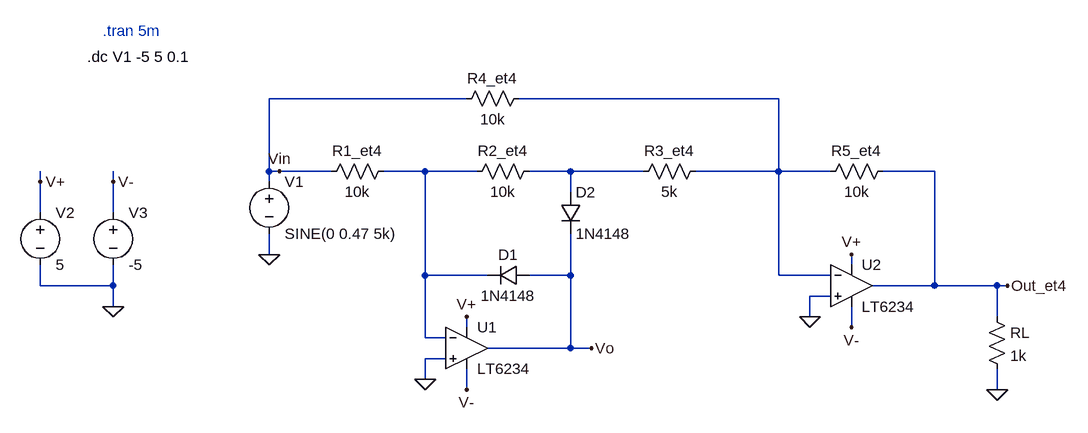
[diagram p0: schematic etaj4.asc]
etaj4.asc, the LTspice schematic file:
Version 4
SHEET 1 956 680
WIRE 0 -416 -304 -416
WIRE 480 -416 80 -416
WIRE -304 -304 -304 -416
WIRE -288 -304 -304 -304
WIRE -208 -304 -288 -304
WIRE -64 -304 -128 -304
WIRE 16 -304 -64 -304
WIRE 160 -304 96 -304
WIRE 272 -304 160 -304
WIRE 480 -304 480 -416
WIRE 480 -304 352 -304
WIRE 560 -304 480 -304
WIRE 720 -304 640 -304
WIRE -656 -288 -656 -304
WIRE -544 -288 -544 -304
WIRE -304 -288 -304 -304
WIRE 160 -272 160 -304
WIRE -656 -240 -656 -288
WIRE -544 -240 -544 -288
WIRE -304 -176 -304 -208
WIRE 592 -160 592 -176
WIRE -64 -144 -64 -304
WIRE 32 -144 -64 -144
WIRE 160 -144 160 -208
WIRE 160 -144 96 -144
WIRE 480 -144 480 -304
WIRE 560 -144 480 -144
WIRE -656 -128 -656 -160
WIRE -544 -128 -544 -160
WIRE -544 -128 -656 -128
WIRE 720 -128 720 -304
WIRE 720 -128 624 -128
WIRE 816 -128 720 -128
WIRE 832 -128 816 -128
WIRE 560 -112 528 -112
WIRE -544 -96 -544 -128
WIRE 528 -80 528 -112
WIRE 816 -80 816 -128
WIRE 0 -64 0 -80
WIRE 592 -64 592 -96
WIRE -64 -48 -64 -144
WIRE -32 -48 -64 -48
WIRE 160 -32 160 -144
WIRE 160 -32 32 -32
WIRE 192 -32 160 -32
WIRE -32 -16 -64 -16
WIRE -64 16 -64 -16
WIRE 0 32 0 0
WIRE 816 32 816 0
FLAG -304 -176 0
FLAG 832 -128 Out_et4
FLAG -544 -96 0
FLAG -656 -288 V+
FLAG -544 -288 V-
FLAG 592 -176 V+
FLAG 592 -64 V-
FLAG 816 32 0
FLAG -64 16 0
FLAG 192 -32 Vo
FLAG 0 -80 V+
FLAG 0 32 V-
FLAG 528 -80 0
FLAG -288 -304 Vin
SYMBOL voltage -304 -304 R0
WINDOW 123 0 0 Left 2
WINDOW 39 0 0 Left 2
SYMATTR InstName V1
SYMATTR Value SINE(0 0.47 5k)
SYMBOL voltage -656 -256 R0
WINDOW 123 0 0 Left 2
WINDOW 39 0 0 Left 2
SYMATTR InstName V2
SYMATTR Value 5
SYMBOL voltage -544 -256 R0
WINDOW 123 0 0 Left 2
WINDOW 39 0 0 Left 2
SYMATTR InstName V3
SYMATTR Value -5
SYMBOL res 800 -96 R0
SYMATTR InstName RL
SYMATTR Value 1k
SYMBOL res -112 -320 R90
WINDOW 0 0 56 VBottom 2
WINDOW 3 32 56 VTop 2
SYMATTR InstName R1_et4
SYMATTR Value 10k
SYMBOL res 96 -432 R90
WINDOW 0 0 56 VBottom 2
WINDOW 3 32 56 VTop 2
SYMATTR InstName R4_et4
SYMATTR Value 10k
SYMBOL res 368 -320 R90
WINDOW 0 0 56 VBottom 2
WINDOW 3 32 56 VTop 2
SYMATTR InstName R3_et4
SYMATTR Value 5k
SYMBOL res 656 -320 R90
WINDOW 0 0 56 VBottom 2
WINDOW 3 32 56 VTop 2
SYMATTR InstName R5_et4
SYMATTR Value 10k
SYMBOL res 112 -320 R90
WINDOW 0 0 56 VBottom 2
WINDOW 3 32 56 VTop 2
SYMATTR InstName R2_et4
SYMATTR Value 10k
SYMBOL diode 144 -272 R0
SYMATTR InstName D2
SYMATTR Value 1N4148
SYMBOL diode 96 -160 R90
WINDOW 0 0 32 VBottom 2
WINDOW 3 32 32 VTop 2
SYMATTR InstName D1
SYMATTR Value 1N4148
SYMBOL OpAmps\\LT6234 0 -32 R0
SYMATTR InstName U1
SYMBOL OpAmps\\LT6234 592 -128 R0
SYMATTR InstName U2
TEXT -560 -520 Left 2 ;.tran 5m
TEXT -584 -480 Left 2 !.dc V1 -5 5 0.1

The netlist it stands for:
* etaj4.asc
V1 Vin 0 SINE(0 0.47 5k)
V2 V+ 0 5
V3 V- 0 -5
RL Out_et4 0 1k
R1_et4 N002 Vin 10k
R4_et4 N001 Vin 10k
R3_et4 N001 N003 5k
R5_et4 Out_et4 N001 10k
R2_et4 N003 N002 10k
D2 N003 Vo 1N4148
D1 Vo N002 1N4148
* U1: LT6234 (symbol OpAmps\LT6234 not available, pins judged from their places): In+=0 In-=N002 V+=V+ V-=V- OUT=Vo
* U2: LT6234 (symbol OpAmps\LT6234 not available, pins judged from their places): In+=0 In-=N001 V+=V+ V-=V- OUT=Out_et4
.model D D
.lib standard.dio
* .tran 5m
.dc V1 -5 5 0.1
.backanno
.end